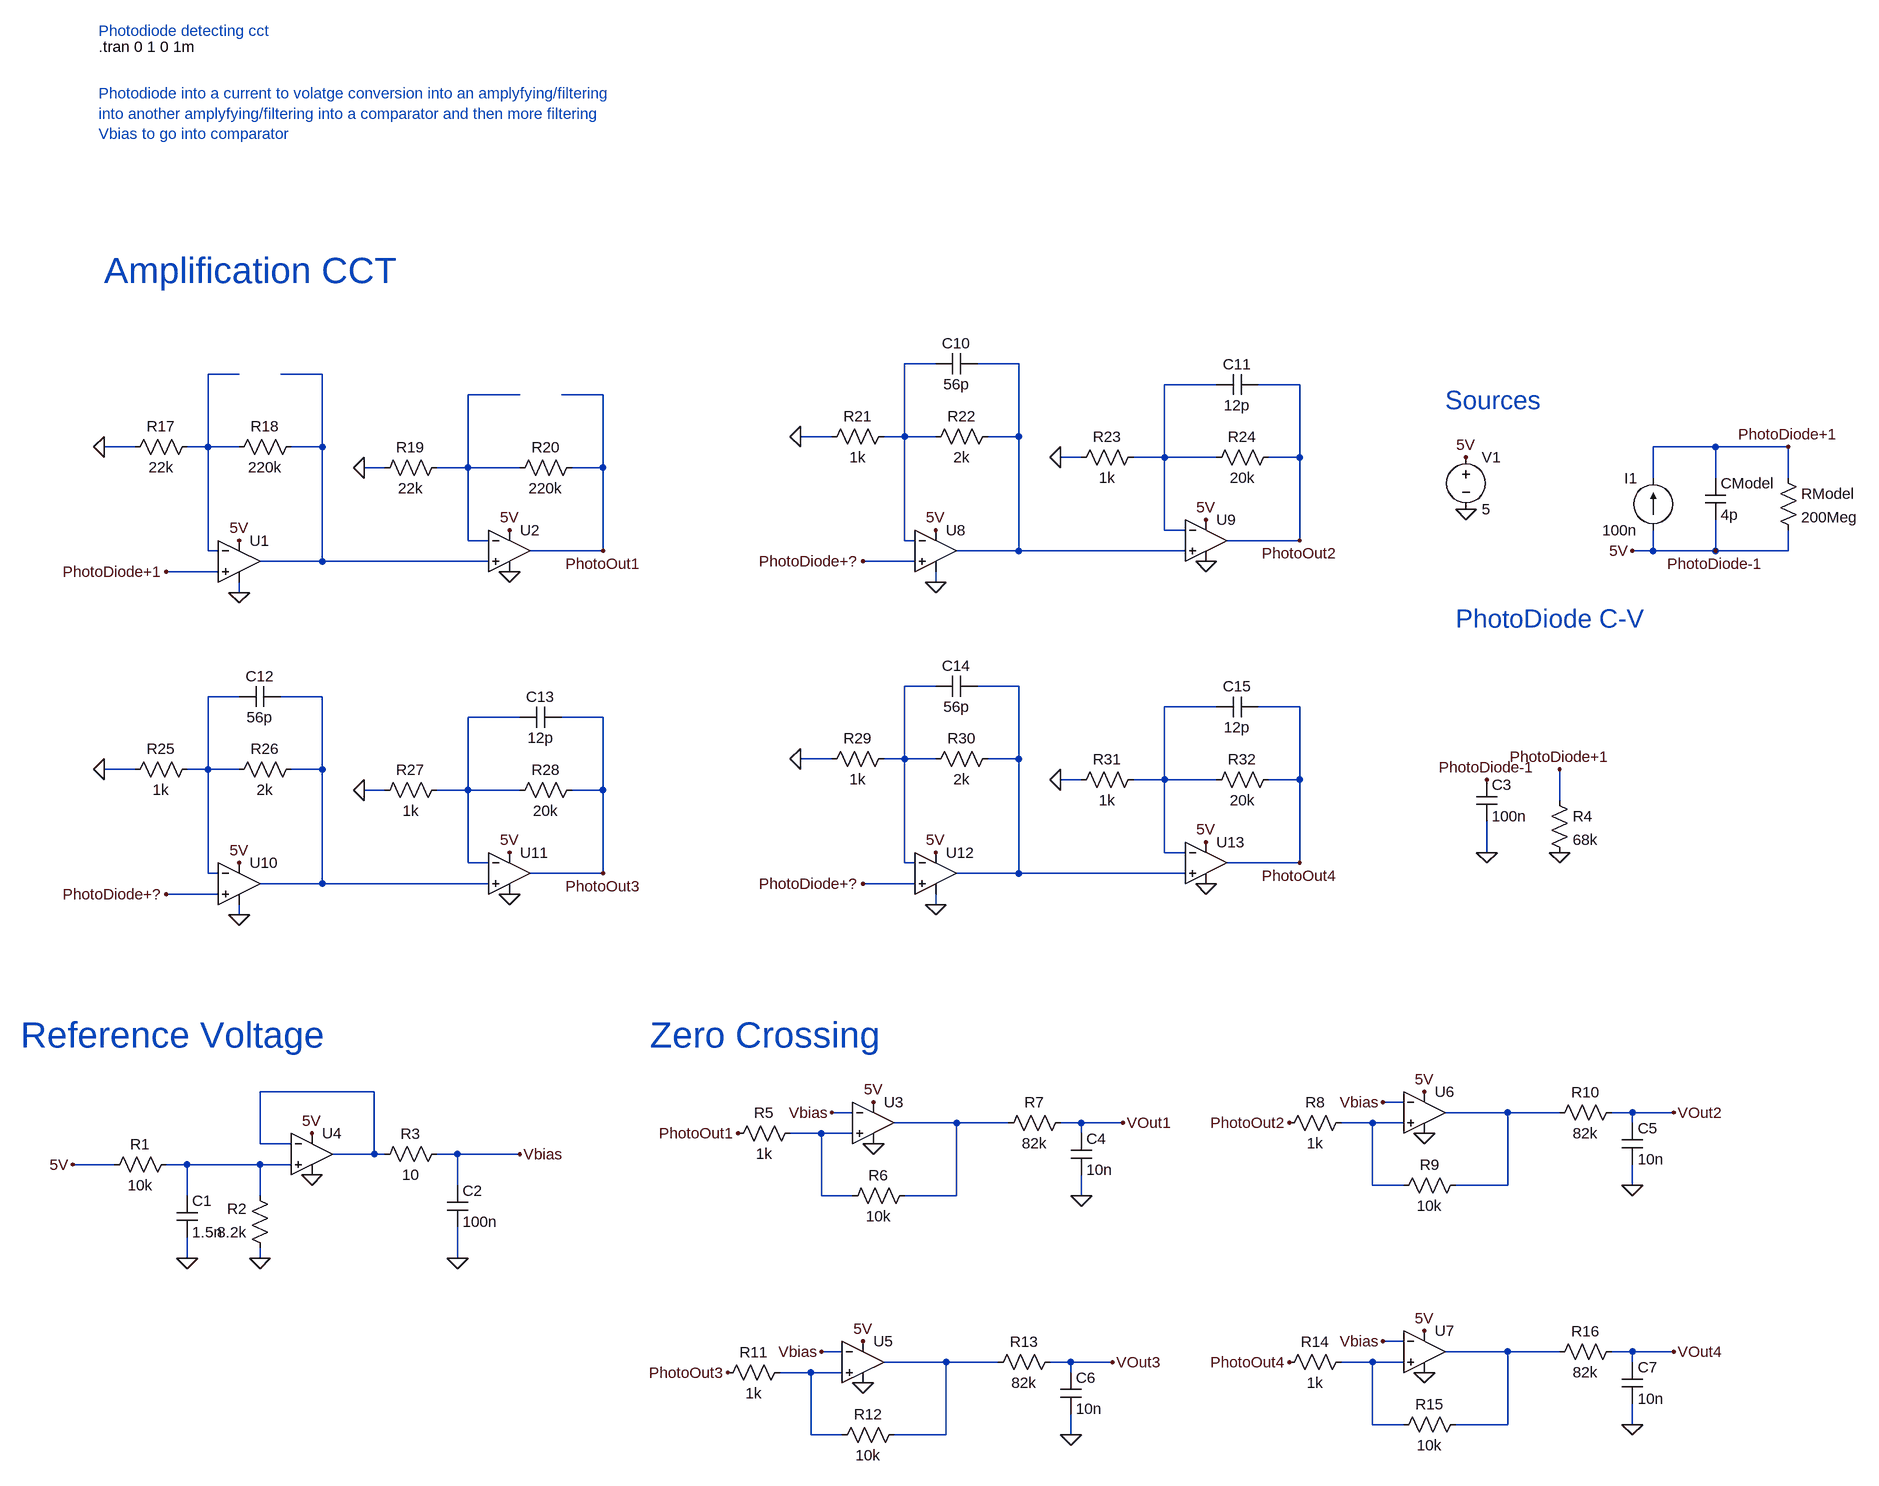
[diagram p0: schematic Photodiode-cct.asc]
Photodiode-cct.asc, the LTspice schematic file:
Version 4.1
SHEET 1 1892 2452
WIRE 160 224 112 224
WIRE 288 224 224 224
WIRE -912 240 -960 240
WIRE -784 240 -848 240
WIRE 592 256 512 256
WIRE 720 256 656 256
WIRE -480 272 -560 272
WIRE -352 272 -416 272
WIRE 0 336 -48 336
WIRE 112 336 112 224
WIRE 112 336 80 336
WIRE 160 336 112 336
WIRE 288 336 288 224
WIRE 288 336 240 336
WIRE -1072 352 -1120 352
WIRE -960 352 -960 240
WIRE -960 352 -992 352
WIRE -912 352 -960 352
WIRE -784 352 -784 240
WIRE -784 352 -832 352
WIRE 1360 352 1264 352
WIRE 1472 352 1360 352
WIRE 384 368 352 368
WIRE 512 368 512 256
WIRE 512 368 464 368
WIRE 592 368 512 368
WIRE 720 368 720 256
WIRE 720 368 672 368
WIRE -688 384 -720 384
WIRE -560 384 -560 272
WIRE -560 384 -608 384
WIRE -480 384 -560 384
WIRE -352 384 -352 272
WIRE -352 384 -400 384
WIRE 1264 400 1264 352
WIRE 1360 400 1360 352
WIRE 1472 400 1472 352
WIRE 512 480 512 368
WIRE 544 480 512 480
WIRE -560 496 -560 384
WIRE -528 496 -560 496
WIRE 112 496 112 336
WIRE 128 496 112 496
WIRE 720 496 720 368
WIRE 720 496 608 496
WIRE -960 512 -960 352
WIRE -944 512 -960 512
WIRE -352 512 -352 384
WIRE -352 512 -464 512
WIRE 288 512 288 336
WIRE 288 512 192 512
WIRE 544 512 288 512
WIRE 1264 512 1264 480
WIRE 1264 512 1232 512
WIRE 1360 512 1360 464
WIRE 1360 512 1264 512
WIRE 1472 512 1472 480
WIRE 1472 512 1360 512
WIRE -784 528 -784 352
WIRE -784 528 -880 528
WIRE -528 528 -784 528
WIRE 128 528 48 528
WIRE -944 544 -1024 544
WIRE 160 560 160 544
WIRE -912 576 -912 560
WIRE 160 720 112 720
WIRE 288 720 224 720
WIRE -912 736 -960 736
WIRE -784 736 -848 736
WIRE 592 752 512 752
WIRE 720 752 656 752
WIRE -480 768 -560 768
WIRE -352 768 -416 768
WIRE 0 832 -48 832
WIRE 112 832 112 720
WIRE 112 832 80 832
WIRE 160 832 112 832
WIRE 288 832 288 720
WIRE 288 832 240 832
WIRE -1072 848 -1120 848
WIRE -960 848 -960 736
WIRE -960 848 -992 848
WIRE -912 848 -960 848
WIRE -784 848 -784 736
WIRE -784 848 -832 848
WIRE 384 864 352 864
WIRE 512 864 512 752
WIRE 512 864 464 864
WIRE 592 864 512 864
WIRE 720 864 720 752
WIRE 720 864 672 864
WIRE -688 880 -720 880
WIRE -560 880 -560 768
WIRE -560 880 -608 880
WIRE -480 880 -560 880
WIRE -352 880 -352 768
WIRE -352 880 -400 880
WIRE 1120 896 1120 848
WIRE 512 976 512 864
WIRE 544 976 512 976
WIRE 1008 976 1008 928
WIRE -560 992 -560 880
WIRE -528 992 -560 992
WIRE 112 992 112 832
WIRE 128 992 112 992
WIRE 720 992 720 864
WIRE 720 992 608 992
WIRE -960 1008 -960 848
WIRE -944 1008 -960 1008
WIRE -352 1008 -352 880
WIRE -352 1008 -464 1008
WIRE 288 1008 288 832
WIRE 288 1008 192 1008
WIRE 544 1008 288 1008
WIRE -784 1024 -784 848
WIRE -784 1024 -880 1024
WIRE -528 1024 -784 1024
WIRE 128 1024 48 1024
WIRE -944 1040 -1024 1040
WIRE 160 1056 160 1040
WIRE -912 1072 -912 1056
WIRE -704 1344 -880 1344
WIRE 880 1360 848 1360
WIRE 32 1376 0 1376
WIRE 1040 1376 944 1376
WIRE 1120 1376 1040 1376
WIRE 1232 1376 1200 1376
WIRE 1296 1376 1232 1376
WIRE 192 1392 96 1392
WIRE 272 1392 192 1392
WIRE 384 1392 352 1392
WIRE 448 1392 384 1392
WIRE 832 1392 784 1392
WIRE 880 1392 832 1392
WIRE 1232 1392 1232 1376
WIRE -16 1408 -64 1408
WIRE 32 1408 -16 1408
WIRE 384 1408 384 1392
WIRE -880 1424 -880 1344
WIRE -832 1424 -880 1424
WIRE -704 1440 -704 1344
WIRE -704 1440 -768 1440
WIRE -688 1440 -704 1440
WIRE -576 1440 -608 1440
WIRE -480 1440 -576 1440
WIRE -1104 1456 -1168 1456
WIRE -992 1456 -1024 1456
WIRE -880 1456 -992 1456
WIRE -832 1456 -880 1456
WIRE -576 1488 -576 1440
WIRE 832 1488 832 1392
WIRE 880 1488 832 1488
WIRE 1040 1488 1040 1376
WIRE 1040 1488 960 1488
WIRE 1232 1488 1232 1456
WIRE -992 1504 -992 1456
WIRE -880 1504 -880 1456
WIRE -16 1504 -16 1408
WIRE 32 1504 -16 1504
WIRE 192 1504 192 1392
WIRE 192 1504 112 1504
WIRE 384 1504 384 1472
WIRE -992 1600 -992 1568
WIRE -880 1600 -880 1584
WIRE -576 1600 -576 1552
WIRE 880 1728 848 1728
WIRE 16 1744 -16 1744
WIRE 1040 1744 944 1744
WIRE 1120 1744 1040 1744
WIRE 1232 1744 1200 1744
WIRE 1296 1744 1232 1744
WIRE 176 1760 80 1760
WIRE 256 1760 176 1760
WIRE 368 1760 336 1760
WIRE 432 1760 368 1760
WIRE 832 1760 784 1760
WIRE 880 1760 832 1760
WIRE 1232 1760 1232 1744
WIRE -32 1776 -80 1776
WIRE 16 1776 -32 1776
WIRE 368 1776 368 1760
WIRE 832 1856 832 1760
WIRE 880 1856 832 1856
WIRE 1040 1856 1040 1744
WIRE 1040 1856 960 1856
WIRE 1232 1856 1232 1824
WIRE -32 1872 -32 1776
WIRE 16 1872 -32 1872
WIRE 176 1872 176 1760
WIRE 176 1872 96 1872
WIRE 368 1872 368 1840
FLAG -912 496 5V
FLAG -912 576 0
FLAG 1008 976 0
FLAG -1120 352 0
FLAG 448 1392 VOut1
FLAG -496 544 0
FLAG -496 480 5V
FLAG 64 1360 5V
FLAG 64 1424 0
FLAG -800 1408 5V
FLAG -800 1472 0
FLAG 976 448 0
FLAG 976 368 5V
FLAG -1168 1456 5V
FLAG -992 1600 0
FLAG -880 1600 0
FLAG -576 1600 0
FLAG -480 1440 Vbias
FLAG -720 384 0
FLAG 0 1376 Vbias
FLAG 384 1504 0
FLAG 1232 512 5V
FLAG 1472 352 PhotoDiode+1
FLAG 1120 848 PhotoDiode+1
FLAG 1008 864 PhotoDiode-1
FLAG 1360 512 PhotoDiode-1
FLAG 1120 976 0
FLAG 432 1760 VOut3
FLAG 48 1728 5V
FLAG 48 1792 0
FLAG -16 1744 Vbias
FLAG 368 1872 0
FLAG 1296 1376 VOut2
FLAG 912 1344 5V
FLAG 912 1408 0
FLAG 848 1360 Vbias
FLAG 1232 1488 0
FLAG 1296 1744 VOut4
FLAG 912 1712 5V
FLAG 912 1776 0
FLAG 848 1728 Vbias
FLAG 1232 1856 0
FLAG -1024 544 PhotoDiode+1
FLAG -352 512 PhotoOut1
FLAG -144 1408 PhotoOut1
FLAG -160 1776 PhotoOut3
FLAG 704 1392 PhotoOut2
FLAG 704 1760 PhotoOut4
FLAG 160 480 5V
FLAG 160 560 0
FLAG -48 336 0
FLAG 576 528 0
FLAG 576 464 5V
FLAG 352 368 0
FLAG 48 528 PhotoDiode+?
FLAG 720 496 PhotoOut2
FLAG -912 992 5V
FLAG -912 1072 0
FLAG -1120 848 0
FLAG -496 1040 0
FLAG -496 976 5V
FLAG -720 880 0
FLAG -1024 1040 PhotoDiode+?
FLAG -352 1008 PhotoOut3
FLAG 160 976 5V
FLAG 160 1056 0
FLAG -48 832 0
FLAG 576 1024 0
FLAG 576 960 5V
FLAG 352 864 0
FLAG 48 1024 PhotoDiode+?
FLAG 720 992 PhotoOut4
SYMBOL res 1456 384 R0
SYMATTR InstName RModel
SYMATTR Value 200Meg
SYMBOL cap 1344 400 R0
SYMATTR InstName CModel
SYMATTR Value 4p
SYMBOL current 1264 480 R180
WINDOW 0 24 80 Left 2
WINDOW 3 24 0 Left 2
WINDOW 123 0 0 Left 0
WINDOW 39 0 0 Left 0
SYMATTR InstName I1
SYMATTR Value 100n
SYMBOL cap 992 864 R0
SYMATTR InstName C3
SYMATTR Value 100n
SYMBOL res 1104 880 R0
SYMATTR InstName R4
SYMATTR Value 68k
SYMBOL OpAmps\\UniversalOpAmp2 -912 528 R0
SYMATTR InstName U1
SYMBOL res -816 336 R90
WINDOW 0 0 56 VBottom 2
WINDOW 3 32 56 VTop 2
SYMATTR InstName R18
SYMATTR Value 220k
SYMBOL res -976 336 R90
WINDOW 0 0 56 VBottom 2
WINDOW 3 32 56 VTop 2
SYMATTR InstName R17
SYMATTR Value 22k
SYMBOL OpAmps\\UniversalOpAmp2 -496 512 R0
SYMATTR InstName U2
SYMBOL OpAmps\\UniversalOpAmp2 64 1392 R0
SYMATTR InstName U3
SYMBOL OpAmps\\UniversalOpAmp2 -800 1440 R0
SYMATTR InstName U4
SYMBOL voltage 976 352 R0
WINDOW 123 0 0 Left 0
WINDOW 39 0 0 Left 0
SYMATTR InstName V1
SYMATTR Value 5
SYMBOL res -1008 1440 R90
WINDOW 0 0 56 VBottom 2
WINDOW 3 32 56 VTop 2
SYMATTR InstName R1
SYMATTR Value 10k
SYMBOL res -864 1600 R180
WINDOW 0 36 76 Left 2
WINDOW 3 36 40 Left 2
SYMATTR InstName R2
SYMATTR Value 8.2k
SYMBOL cap -1008 1504 R0
SYMATTR InstName C1
SYMATTR Value 1.5n
SYMBOL cap -592 1488 R0
SYMATTR InstName C2
SYMATTR Value 100n
SYMBOL res -592 1424 R90
WINDOW 0 0 56 VBottom 2
WINDOW 3 32 56 VTop 2
SYMATTR InstName R3
SYMATTR Value 10
SYMBOL res -592 368 R90
WINDOW 0 0 56 VBottom 2
WINDOW 3 32 56 VTop 2
SYMATTR InstName R19
SYMATTR Value 22k
SYMBOL res -384 368 R90
WINDOW 0 0 56 VBottom 2
WINDOW 3 32 56 VTop 2
SYMATTR InstName R20
SYMATTR Value 220k
SYMBOL res 128 1488 R90
WINDOW 0 0 56 VBottom 2
WINDOW 3 32 56 VTop 2
SYMATTR InstName R6
SYMATTR Value 10k
SYMBOL res -48 1392 R90
WINDOW 0 0 56 VBottom 2
WINDOW 3 32 56 VTop 2
SYMATTR InstName R5
SYMATTR Value 1k
SYMBOL res 368 1376 R90
WINDOW 0 0 56 VBottom 2
WINDOW 3 32 56 VTop 2
SYMATTR InstName R7
SYMATTR Value 82k
SYMBOL cap 368 1408 R0
SYMATTR InstName C4
SYMATTR Value 10n
SYMBOL OpAmps\\UniversalOpAmp2 48 1760 R0
SYMATTR InstName U5
SYMBOL res 112 1856 R90
WINDOW 0 0 56 VBottom 2
WINDOW 3 32 56 VTop 2
SYMATTR InstName R12
SYMATTR Value 10k
SYMBOL res -64 1760 R90
WINDOW 0 0 56 VBottom 2
WINDOW 3 32 56 VTop 2
SYMATTR InstName R11
SYMATTR Value 1k
SYMBOL res 352 1744 R90
WINDOW 0 0 56 VBottom 2
WINDOW 3 32 56 VTop 2
SYMATTR InstName R13
SYMATTR Value 82k
SYMBOL cap 352 1776 R0
SYMATTR InstName C6
SYMATTR Value 10n
SYMBOL OpAmps\\UniversalOpAmp2 912 1376 R0
SYMATTR InstName U6
SYMBOL res 976 1472 R90
WINDOW 0 0 56 VBottom 2
WINDOW 3 32 56 VTop 2
SYMATTR InstName R9
SYMATTR Value 10k
SYMBOL res 800 1376 R90
WINDOW 0 0 56 VBottom 2
WINDOW 3 32 56 VTop 2
SYMATTR InstName R8
SYMATTR Value 1k
SYMBOL res 1216 1360 R90
WINDOW 0 0 56 VBottom 2
WINDOW 3 32 56 VTop 2
SYMATTR InstName R10
SYMATTR Value 82k
SYMBOL cap 1216 1392 R0
SYMATTR InstName C5
SYMATTR Value 10n
SYMBOL OpAmps\\UniversalOpAmp2 912 1744 R0
SYMATTR InstName U7
SYMBOL res 976 1840 R90
WINDOW 0 0 56 VBottom 2
WINDOW 3 32 56 VTop 2
SYMATTR InstName R15
SYMATTR Value 10k
SYMBOL res 800 1744 R90
WINDOW 0 0 56 VBottom 2
WINDOW 3 32 56 VTop 2
SYMATTR InstName R14
SYMATTR Value 1k
SYMBOL res 1216 1728 R90
WINDOW 0 0 56 VBottom 2
WINDOW 3 32 56 VTop 2
SYMATTR InstName R16
SYMATTR Value 82k
SYMBOL cap 1216 1760 R0
SYMATTR InstName C7
SYMATTR Value 10n
SYMBOL OpAmps\\UniversalOpAmp2 160 512 R0
SYMATTR InstName U8
SYMBOL res 256 320 R90
WINDOW 0 0 56 VBottom 2
WINDOW 3 32 56 VTop 2
SYMATTR InstName R22
SYMATTR Value 2k
SYMBOL res 96 320 R90
WINDOW 0 0 56 VBottom 2
WINDOW 3 32 56 VTop 2
SYMATTR InstName R21
SYMATTR Value 1k
SYMBOL cap 224 208 R90
WINDOW 0 0 32 VBottom 2
WINDOW 3 32 32 VTop 2
SYMATTR InstName C10
SYMATTR Value 56p
SYMBOL OpAmps\\UniversalOpAmp2 576 496 R0
SYMATTR InstName U9
SYMBOL res 480 352 R90
WINDOW 0 0 56 VBottom 2
WINDOW 3 32 56 VTop 2
SYMATTR InstName R23
SYMATTR Value 1k
SYMBOL res 688 352 R90
WINDOW 0 0 56 VBottom 2
WINDOW 3 32 56 VTop 2
SYMATTR InstName R24
SYMATTR Value 20k
SYMBOL cap 656 240 R90
WINDOW 0 0 32 VBottom 2
WINDOW 3 32 32 VTop 2
SYMATTR InstName C11
SYMATTR Value 12p
SYMBOL OpAmps\\UniversalOpAmp2 -912 1024 R0
SYMATTR InstName U10
SYMBOL res -816 832 R90
WINDOW 0 0 56 VBottom 2
WINDOW 3 32 56 VTop 2
SYMATTR InstName R26
SYMATTR Value 2k
SYMBOL res -976 832 R90
WINDOW 0 0 56 VBottom 2
WINDOW 3 32 56 VTop 2
SYMATTR InstName R25
SYMATTR Value 1k
SYMBOL cap -848 720 R90
WINDOW 0 0 32 VBottom 2
WINDOW 3 32 32 VTop 2
SYMATTR InstName C12
SYMATTR Value 56p
SYMBOL OpAmps\\UniversalOpAmp2 -496 1008 R0
SYMATTR InstName U11
SYMBOL res -592 864 R90
WINDOW 0 0 56 VBottom 2
WINDOW 3 32 56 VTop 2
SYMATTR InstName R27
SYMATTR Value 1k
SYMBOL res -384 864 R90
WINDOW 0 0 56 VBottom 2
WINDOW 3 32 56 VTop 2
SYMATTR InstName R28
SYMATTR Value 20k
SYMBOL cap -416 752 R90
WINDOW 0 0 32 VBottom 2
WINDOW 3 32 32 VTop 2
SYMATTR InstName C13
SYMATTR Value 12p
SYMBOL OpAmps\\UniversalOpAmp2 160 1008 R0
SYMATTR InstName U12
SYMBOL res 256 816 R90
WINDOW 0 0 56 VBottom 2
WINDOW 3 32 56 VTop 2
SYMATTR InstName R30
SYMATTR Value 2k
SYMBOL res 96 816 R90
WINDOW 0 0 56 VBottom 2
WINDOW 3 32 56 VTop 2
SYMATTR InstName R29
SYMATTR Value 1k
SYMBOL cap 224 704 R90
WINDOW 0 0 32 VBottom 2
WINDOW 3 32 32 VTop 2
SYMATTR InstName C14
SYMATTR Value 56p
SYMBOL OpAmps\\UniversalOpAmp2 576 992 R0
SYMATTR InstName U13
SYMBOL res 480 848 R90
WINDOW 0 0 56 VBottom 2
WINDOW 3 32 56 VTop 2
SYMATTR InstName R31
SYMATTR Value 1k
SYMBOL res 688 848 R90
WINDOW 0 0 56 VBottom 2
WINDOW 3 32 56 VTop 2
SYMATTR InstName R32
SYMATTR Value 20k
SYMBOL cap 656 736 R90
WINDOW 0 0 32 VBottom 2
WINDOW 3 32 32 VTop 2
SYMATTR InstName C15
SYMATTR Value 12p
TEXT -1128 -192 Left 2 ;Photodiode into a current to volatge conversion into an amplyfying/filtering\ninto another amplyfying/filtering into a comparator and then more filtering\nVbias to go into comparator
TEXT -1128 -264 Left 2 !.tran 0 1 0 1m
TEXT -1128 -288 Left 2 ;Photodiode detecting cct
TEXT -1248 1256 Left 5 ;Reference Voltage
TEXT 944 280 Left 4 ;Sources
TEXT -280 1256 Left 5 ;Zero Crossing
TEXT 960 616 Left 4 ;PhotoDiode C-V
TEXT -1120 80 Left 5 ;Amplification CCT

The netlist it stands for:
* Photodiode-cct.asc
RModel PhotoDiode+1 PhotoDiode-1 200Meg
CModel PhotoDiode+1 PhotoDiode-1 4p
I1 PhotoDiode-1 PhotoDiode+1 100n
C3 PhotoDiode-1 0 100n
R4 PhotoDiode+1 0 68k
X§U1 PhotoDiode+1 N003 PhotoDiode-1 0 N004 level2 Avol=1Meg GBW=10Meg Slew=10Meg Ilimit=25m Rail=0 Vos=0 En=0 Enk=0 In=0 Ink=0 Rin=500Meg  ; pins In+ In- V+ V- OUT
R18 N004 N003 220k
R17 N003 0 22k
X§U2 N004 N006 PhotoDiode-1 0 PhotoOut1 level2 Avol=1Meg GBW=10Meg Slew=10Meg Ilimit=25m Rail=0 Vos=0 En=0 Enk=0 In=0 Ink=0 Rin=500Meg  ; pins In+ In- V+ V- OUT
X§U3 N017 Vbias PhotoDiode-1 0 N015 level2 Avol=1Meg GBW=10Meg Slew=10Meg Ilimit=25m Rail=0 Vos=0 En=0 Enk=0 In=0 Ink=0 Rin=500Meg  ; pins In+ In- V+ V- OUT
X§U4 N018 N013 PhotoDiode-1 0 N013 level2 Avol=1Meg GBW=10Meg Slew=10Meg Ilimit=25m Rail=0 Vos=0 En=0 Enk=0 In=0 Ink=0 Rin=500Meg  ; pins In+ In- V+ V- OUT
V1 PhotoDiode-1 0 5
R1 N018 PhotoDiode-1 10k
R2 0 N018 8.2k
C1 N018 0 1.5n
C2 Vbias 0 100n
R3 Vbias N013 10
R19 N006 0 22k
R20 PhotoOut1 N006 220k
R6 N015 N017 10k
R5 N017 PhotoOut1 1k
R7 VOut1 N015 82k
C4 VOut1 0 10n
X§U5 N022 Vbias PhotoDiode-1 0 N020 level2 Avol=1Meg GBW=10Meg Slew=10Meg Ilimit=25m Rail=0 Vos=0 En=0 Enk=0 In=0 Ink=0 Rin=500Meg  ; pins In+ In- V+ V- OUT
R12 N020 N022 10k
R11 N022 PhotoOut3 1k
R13 VOut3 N020 82k
C6 VOut3 0 10n
X§U6 N016 Vbias PhotoDiode-1 0 N014 level2 Avol=1Meg GBW=10Meg Slew=10Meg Ilimit=25m Rail=0 Vos=0 En=0 Enk=0 In=0 Ink=0 Rin=500Meg  ; pins In+ In- V+ V- OUT
R9 N014 N016 10k
R8 N016 PhotoOut2 1k
R10 VOut2 N014 82k
C5 VOut2 0 10n
X§U7 N021 Vbias PhotoDiode-1 0 N019 level2 Avol=1Meg GBW=10Meg Slew=10Meg Ilimit=25m Rail=0 Vos=0 En=0 Enk=0 In=0 Ink=0 Rin=500Meg  ; pins In+ In- V+ V- OUT
R15 N019 N021 10k
R14 N021 PhotoOut4 1k
R16 VOut4 N019 82k
C7 VOut4 0 10n
X§U8 PhotoDiode+? N001 PhotoDiode-1 0 N002 level2 Avol=1Meg GBW=10Meg Slew=10Meg Ilimit=25m Rail=0 Vos=0 En=0 Enk=0 In=0 Ink=0 Rin=500Meg  ; pins In+ In- V+ V- OUT
R22 N002 N001 2k
R21 N001 0 1k
C10 N002 N001 56p
X§U9 N002 N005 PhotoDiode-1 0 PhotoOut2 level2 Avol=1Meg GBW=10Meg Slew=10Meg Ilimit=25m Rail=0 Vos=0 En=0 Enk=0 In=0 Ink=0 Rin=500Meg  ; pins In+ In- V+ V- OUT
R23 N005 0 1k
R24 PhotoOut2 N005 20k
C11 PhotoOut2 N005 12p
X§U10 PhotoDiode+? N009 PhotoDiode-1 0 N010 level2 Avol=1Meg GBW=10Meg Slew=10Meg Ilimit=25m Rail=0 Vos=0 En=0 Enk=0 In=0 Ink=0 Rin=500Meg  ; pins In+ In- V+ V- OUT
R26 N010 N009 2k
R25 N009 0 1k
C12 N010 N009 56p
X§U11 N010 N012 PhotoDiode-1 0 PhotoOut3 level2 Avol=1Meg GBW=10Meg Slew=10Meg Ilimit=25m Rail=0 Vos=0 En=0 Enk=0 In=0 Ink=0 Rin=500Meg  ; pins In+ In- V+ V- OUT
R27 N012 0 1k
R28 PhotoOut3 N012 20k
C13 PhotoOut3 N012 12p
X§U12 PhotoDiode+? N007 PhotoDiode-1 0 N008 level2 Avol=1Meg GBW=10Meg Slew=10Meg Ilimit=25m Rail=0 Vos=0 En=0 Enk=0 In=0 Ink=0 Rin=500Meg  ; pins In+ In- V+ V- OUT
R30 N008 N007 2k
R29 N007 0 1k
C14 N008 N007 56p
X§U13 N008 N011 PhotoDiode-1 0 PhotoOut4 level2 Avol=1Meg GBW=10Meg Slew=10Meg Ilimit=25m Rail=0 Vos=0 En=0 Enk=0 In=0 Ink=0 Rin=500Meg  ; pins In+ In- V+ V- OUT
R31 N011 0 1k
R32 PhotoOut4 N011 20k
C15 PhotoOut4 N011 12p
* Photodiode into a current to volatge conversion into an amplyfying/filtering
* into another amplyfying/filtering into a comparator and then more filtering
* Vbias to go into comparator
.tran 0 1 0 1m
* Photodiode detecting cct
* Reference Voltage
* Sources
* Zero Crossing
* PhotoDiode C-V
* Amplification CCT
.lib UniversalOpAmp2.lib
.backanno
.end